# Altium schematic sheet transform.SchDoc
size A4
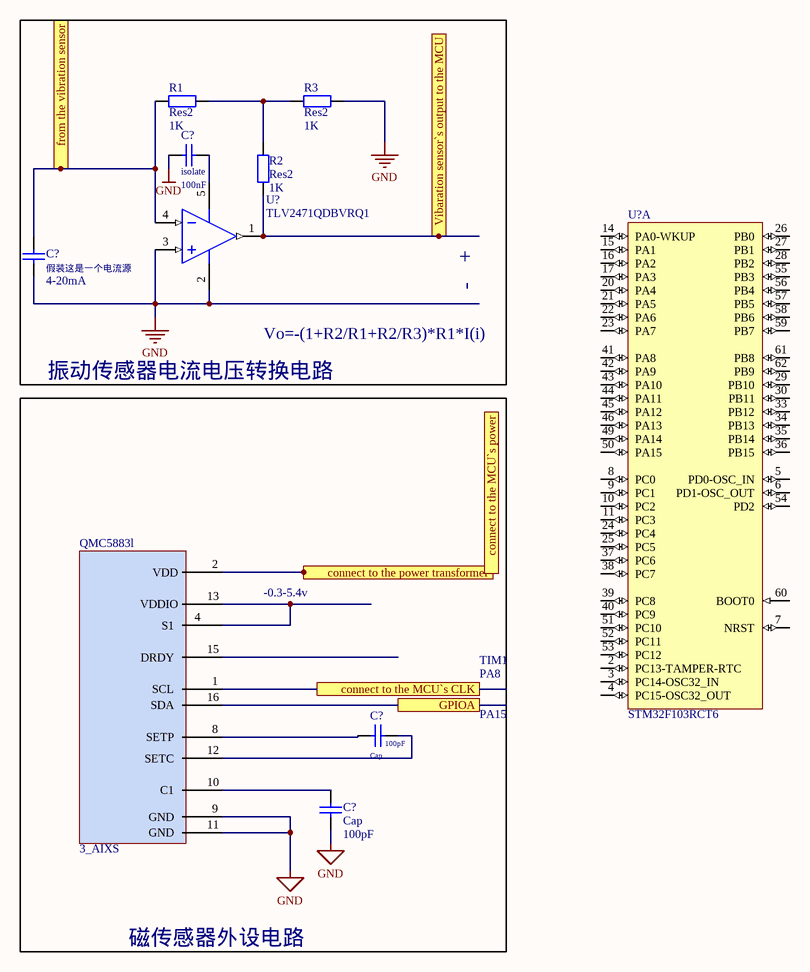
[diagram p0: transform.SchDoc]

## Parts
(Parts that share a designator on the sheet are numbered #1, #2 ... from top to bottom, then left to right.)
C?#1  isolate  value 100nF  [RAD-0.3]
C?#2  假装这是一个电流源  value 4-20mA  [RAD-0.3]
C?#3  Cap  value 100pF  [RAD-0.3]
C?#4  Cap  value 100pF  [RAD-0.3]
QMC5883l  3_AIXS
R1  Res2  value 1K  [AXIAL-0.4]
R2  Res2  value 1K  [AXIAL-0.4]
R3  Res2  value 1K  [AXIAL-0.4]
U?#1  TLV2471QDBVRQ1  [TI-DBV5_N]
U?#2  STM32F103RCT6  [STM-LQFP64_N]  (part A of 2)

## Ports
connect to the MCU`s CLK, connect to the MCU`s power, connect to the power transformer, from the vibration sensor, GPIOA, Vibaration sensor`s output to the MCU

## Nets
GND: C?#1.2 C?#2.1 C?#4.1 QMC5883l.9(GND) QMC5883l.11(GND) R3.1 U?#1.2(GND) U?#1.3(IN+)
connect to the MCU`s CLK: QMC5883l.1(SCL) ; port connect to the MCU`s CLK
connect to the power transformer: QMC5883l.2(VDD) ; port connect to the power transformer
from the vibration sensor: C?#2.2 R1.1 U?#1.4(IN-) ; port from the vibration sensor
GPIOA: QMC5883l.16(SDA) ; port GPIOA
Vibaration sensor`s output to the MCU: R2.1 U?#1.1(OUT) ; port Vibaration sensor`s output to the MCU
NetC?#1_1: C?#1.1 U?#1.5(VDD)
NetC?#3_1: C?#3.1 QMC5883l.12(SETC)
NetC?#3_2: C?#3.2 QMC5883l.8(SETP)
NetC?#4_2: C?#4.2 QMC5883l.10(C1)
NetQMC5883l_4: QMC5883l.4(S1) QMC5883l.13(VDDIO)
NetR1_2: R1.2 R2.2 R3.2

Not connected (* = marked no-connect by the designer): QMC5883l 15(DRDY); U?#2 2(PC13-TAMPER-RTC) 3(PC14-OSC32_IN) 4(PC15-OSC32_OUT) 5(PD0-OSC_IN) 6(PD1-OSC_OUT) 7(NRST) 8(PC0) 9(PC1) 10(PC2) 11(PC3) 14(PA0-WKUP) 15(PA1) 16(PA2) 17(PA3) 20(PA4) 21(PA5) 22(PA6) 23(PA7) 24(PC4) 25(PC5) 26(PB0) 27(PB1) 28(PB2) 29(PB10) 30(PB11) 33(PB12) 34(PB13) 35(PB14) 36(PB15) 37(PC6) 38(PC7) 39(PC8) 40(PC9) 41(PA8) 42(PA9) 43(PA10) 44(PA11) 45(PA12) 46(PA13) 49(PA14) 50(PA15) 51(PC10) 52(PC11) 53(PC12) 54(PD2) 55(PB3) 56(PB4) 57(PB5) 58(PB6) 59(PB7) 60(BOOT0) 61(PB8) 62(PB9)

## Notes on the sheet
- +
- -
- Vo=-(1+R2/R1+R2/R3)*R1*I(i)
- 振动传感器电流电压转换电路
- -0.3-5.4v
- TIM1
- PA8
- PA15
- 磁传感器外设电路

## Library data of the parts
C?#1-C?#4 = Cap: Capacitor; Published: 8-Jun-2000; LatestRevisionDate: 17-Jul-2002; LatestRevisionNote: Re-released for DXP Platform.; PackageReference: RAD-0.3; Publisher: Altium Limited; PackageDescription: Radial Cap, Thru-Hole; 2 Leads; 0.3 in Pin Spacing
QMC5883l = QMC5883L
R1-R3 = Res2: Resistor; Published: 8-Jun-2000; LatestRevisionDate: 17-Jul-2002; LatestRevisionNote: Re-released for DXP Platform.; PackageReference: AXIAL-0.4; Publisher: Altium Limited; PackageDescription: Axial Device, Thru-Hole; 2 Leads; 0.4 in Pin Spacing
U?#1 = TLV2471QDBVRQ1: Automotive Catalog 600 uA/Ch 2.8 MHz Rail-to-Rail Input / Output High-Drive Operational Amplifier, 2.7 to 6 V, -40 to 125 degC, 5-pin SOT23 (DBV5), Green (RoHS & no Sb/Br); Manufacturer: Texas Instruments; CMRR(Min)(dB): 58; GBW(Typ)(MHz): 2.8; IIB(Max)(pA): 50; Iq per channel(Max)(mA): 0.75; Number of Channels: 1; Offset Drift(Typ)(uV/C): 0.4; Packing: LARGE T&R; Slew Rate(Typ)(V/us): 1.4; Sub Family: Low Supply Voltage Amplifier (<=2.7V), Precision Amplifier; Total Supply Voltage(Max)(+5V is 5, +/-5V is 10): 6; Total Supply Voltage(Min)(+5V is 5, +/-5V is 10): 2.7; Vio (25C)(Max)(mV): 2.2; DatasheetVersion: SGLS180B; PackageVersion: 4073253-4/K, 03/2006; PackageReference: DBV5; PackageDescription: 5-Pin Plastic Small Outline, Body 1.6 x 2.9 mm, Pitch 0.95 mm; Eco-Plan: Green (RoHS & no Sb/Br); Rating: Automotive; Mounting Technology: Surface Mount; Code_JEDEC: MO-178; PartNumber: TLV2471QDBVRQ1; ComponentLink1Description: Manufacturer URL; ComponentLink1URL: http://www.ti.com/; ComponentLink2Description: Datasheet; ComponentLink2URL: http://www.ti.com/lit/ds/symlink/tlv2471-q1.pdf; ComponentLink3Description: Package Specification; ComponentLink3URL: http://www.ti.com/litv/pdf/mpds018i
U?#2 = STM32F103RCT6: ARM Cortex-M3 32-bit MCU, 256 KB Flash, 48 KB Internal RAM, 51 I/Os, 64-pin LQFP, -40 to 85 degC, Tray; A/D Converter: 3x12-bit (16 Channel); D/A Converter: 2x12-bit (2 Channel); FLASH Size (Prog) (kB): 256; I/Os (High Current): 51; Internal RAM Size (kB): 48; Operating Frequency(F) (Processor speed) (MHz): 72; Supply Voltage(Vcc) min (V): 2; DatasheetVersion: Rev. 8; PackageVersion: Rev. 4, 06/2013; PackageReference: LQFP64; PackageDescription: 64-Pin Low Profile Quad Flat Package, 10 x 10 mm Body, 0.5 mm Pitch; Supplier 1: Digi-Key; Supplier Part Number 1: 497-9033-ND; Supplier 2: Newark; Supplier Part Number 2: 01P4099; Supplier 3: Newark; Supplier Part Number 3: 57P1227; Supplier 4: Mouser; Supplier Part Number 4: 511-STM32F103RCT6; Core: ARM Cortex-M3; Packing: Tray; Mounting Technology: Surface Mount; PartNumber: STM32F103RCT6; ComponentLink1Description: Manufacturer URL; ComponentLink1URL: http://www.st.com/web/en/home.html; ComponentLink2Description: Datasheet; ComponentLink2URL: http://www.st.com/st-web-ui/static/active/en/resource/technical/document/datasheet/CD00191185.pdf; ComponentLink3Description: Package Specification; ComponentLink3URL: http://www.st.com/st-web-ui/static/active/en/resource/technical/document/datasheet/DM00037051.pdf